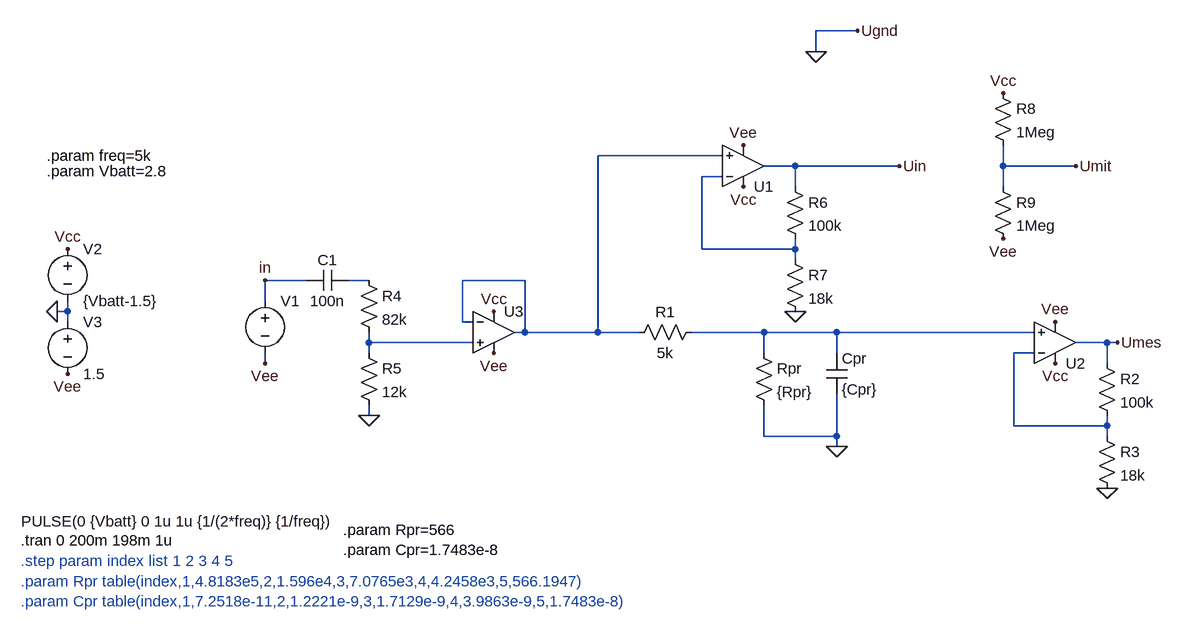
[diagram p0: schematic SimulationProbeModelAsymetry.asc]
SimulationProbeModelAsymetry.asc, the LTspice schematic file:
Version 4
SHEET 1 1980 1244
WIRE 352 -368 288 -368
WIRE 288 -336 288 -368
WIRE 144 -176 -48 -176
WIRE 256 -160 208 -160
WIRE 416 -160 256 -160
WIRE 576 -160 576 -192
WIRE 688 -160 576 -160
WIRE 144 -144 112 -144
WIRE 256 -128 256 -160
WIRE 576 -128 576 -160
WIRE 112 -32 112 -144
WIRE 256 -32 256 -48
WIRE 256 -32 112 -32
WIRE 256 -16 256 -32
WIRE -496 16 -560 16
WIRE -400 16 -432 16
WIRE -160 16 -256 16
WIRE -560 48 -560 16
WIRE -864 64 -864 48
WIRE -864 64 -880 64
WIRE -864 80 -864 64
WIRE -256 80 -256 16
WIRE -240 80 -256 80
WIRE -160 96 -160 16
WIRE -160 96 -176 96
WIRE -48 96 -48 -176
WIRE -48 96 -160 96
WIRE 16 96 -48 96
WIRE 208 96 96 96
WIRE 320 96 208 96
WIRE 624 96 320 96
WIRE -400 112 -400 96
WIRE -240 112 -400 112
WIRE 736 112 688 112
WIRE 752 112 736 112
WIRE -400 128 -400 112
WIRE 208 128 208 96
WIRE 320 128 320 96
WIRE 624 128 592 128
WIRE -560 144 -560 128
WIRE 736 144 736 112
WIRE -400 224 -400 208
WIRE 592 240 592 128
WIRE 736 240 736 224
WIRE 736 240 592 240
WIRE 208 256 208 208
WIRE 320 256 320 192
WIRE 320 256 208 256
WIRE 736 256 736 240
WIRE 320 272 320 256
FLAG -864 160 Vee
FLAG -864 -32 Vcc
FLAG -880 64 0
FLAG -560 16 in
FLAG 320 272 0
FLAG -560 144 Vee
FLAG -208 64 Vcc
FLAG -208 128 Vee
FLAG 752 112 Umes
FLAG 416 -160 Uin
FLAG 352 -368 Ugnd
FLAG 288 -336 0
FLAG -400 224 0
FLAG 656 144 Vcc
FLAG 656 80 Vee
FLAG 736 336 0
FLAG 176 -128 Vcc
FLAG 176 -192 Vee
FLAG 256 64 0
FLAG 576 -272 Vcc
FLAG 576 -48 Vee
FLAG 688 -160 Umit
SYMBOL voltage -560 32 R0
WINDOW 3 -375 355 Left 2
WINDOW 123 0 0 Left 2
WINDOW 39 0 0 Left 2
SYMATTR Value PULSE(0 {Vbatt} 0 1u 1u {1/(2*freq)} {1/freq})
SYMATTR InstName V1
SYMBOL res 0 112 R270
WINDOW 0 32 56 VTop 2
WINDOW 3 0 56 VBottom 2
SYMATTR InstName R1
SYMATTR Value 5k
SYMBOL res 192 112 R0
SYMATTR InstName Rpr
SYMATTR Value {Rpr}
SYMBOL cap 304 128 R0
SYMATTR InstName Cpr
SYMATTR Value {Cpr}
SYMBOL voltage -864 -48 R0
WINDOW 123 0 0 Left 2
WINDOW 39 0 0 Left 2
SYMATTR InstName V2
SYMATTR Value {Vbatt-1.5}
SYMBOL voltage -864 64 R0
WINDOW 123 0 0 Left 2
WINDOW 39 0 0 Left 2
SYMATTR InstName V3
SYMATTR Value 1.5
SYMBOL res -416 0 R0
SYMATTR InstName R4
SYMATTR Value 82k
SYMBOL res -416 112 R0
SYMATTR InstName R5
SYMATTR Value 12k
SYMBOL cap -432 0 R90
WINDOW 0 0 32 VBottom 2
WINDOW 3 32 32 VTop 2
SYMATTR InstName C1
SYMATTR Value 100n
SYMBOL Opamps\\UniversalOpamp2 -208 96 R0
SYMATTR InstName U3
SYMBOL Opamps\\UniversalOpamp2 656 112 M180
SYMATTR InstName U2
SYMBOL res 720 128 R0
SYMATTR InstName R2
SYMATTR Value 100k
SYMBOL res 720 240 R0
SYMATTR InstName R3
SYMATTR Value 18k
SYMBOL Opamps\\UniversalOpamp2 176 -160 M180
SYMATTR InstName U1
SYMBOL res 240 -144 R0
SYMATTR InstName R6
SYMATTR Value 100k
SYMBOL res 240 -32 R0
SYMATTR InstName R7
SYMATTR Value 18k
SYMBOL res 560 -288 R0
SYMATTR InstName R8
SYMATTR Value 1Meg
SYMBOL res 560 -144 R0
SYMATTR InstName R9
SYMATTR Value 1Meg
TEXT -896 -176 Left 2 !.param freq=5k
TEXT -896 -152 Left 2 !.param Vbatt=2.8
TEXT -936 416 Left 2 !.tran 0 200m 198m 1u
TEXT -936 448 Left 2 ;.step param index list 1 2 3 4 5\n.param Rpr table(index,1,4.8183e5,2,1.596e4,3,7.0765e3,4,4.2458e3,5,566.1947)\n.param Cpr table(index,1,7.2518e-11,2,1.2221e-9,3,1.7129e-9,4,3.9863e-9,5,1.7483e-8)
TEXT -440 400 Left 2 !.param Rpr=566\n.param Cpr=1.7483e-8

The netlist it stands for:
* SimulationProbeModelAsymetry.asc
V1 in Vee PULSE(0 {Vbatt} 0 1u 1u {1/(2*freq)} {1/freq})
R1 N001 N004 5k
Rpr N004 0 {Rpr}
Cpr N004 0 {Cpr}
V2 Vcc 0 {Vbatt-1.5}
V3 0 Vee 1.5
R4 N003 N005 82k
R5 N005 0 12k
C1 N003 in 100n
XU3 N005 N001 Vcc Vee N001 level.2 Avol=1Meg GBW=10Meg Slew=10Meg ilimit=25m rail=0 Vos=0 phimargin=45 en=0 enk=0 in=0 ink=0 Rin=500Meg  ; pins IN+ IN- V+ V- OUT
XU2 N004 N006 Vcc Vee Umes level.2 Avol=1Meg GBW=10Meg Slew=10Meg ilimit=25m rail=0 Vos=0 phimargin=45 en=0 enk=0 in=0 ink=0 Rin=500Meg  ; pins IN+ IN- V+ V- OUT
R2 Umes N006 100k
R3 N006 0 18k
XU1 N001 N002 Vcc Vee Uin level.2 Avol=1Meg GBW=10Meg Slew=10Meg ilimit=25m rail=0 Vos=0 phimargin=45 en=0 enk=0 in=0 ink=0 Rin=500Meg  ; pins IN+ IN- V+ V- OUT
R6 Uin N002 100k
R7 N002 0 18k
R8 Vcc Umit 1Meg
R9 Umit Vee 1Meg
.param freq=5k
.param Vbatt=2.8
.tran 0 200m 198m 1u
* .step param index list 1 2 3 4 5
* .param Rpr table(index,1,4.8183e5,2,1.596e4,3,7.0765e3,4,4.2458e3,5,566.1947)
* .param Cpr table(index,1,7.2518e-11,2,1.2221e-9,3,1.7129e-9,4,3.9863e-9,5,1.7483e-8)
.param Rpr=566
.param Cpr=1.7483e-8
.lib UniversalOpamps2.sub
.backanno
.end